# EAGLE design adapter-STDC14-DIL (EAGLE 9.6.2)
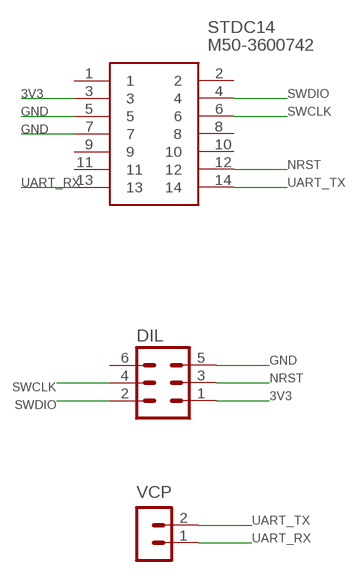
[diagram p0: schematic, sheet 1]

## Parts
DIL  MA03-2  [MA03-2]
STDC14  M50-3600742  [M50-3600742]
VCP  MA02-1  [MA02-1]

## Nets
3V3: DIL.1 STDC14.3
GND: DIL.5 STDC14.5 STDC14.7
NRST: DIL.3 STDC14.12
SWCLK: DIL.4 STDC14.6
SWDIO: DIL.2 STDC14.4
UART_RX: STDC14.13 VCP.1
UART_TX: STDC14.14 VCP.2
Unconnected: DIL.6 STDC14.1 STDC14.2 STDC14.8 STDC14.9 STDC14.10 STDC14.11

## Library data of the parts
DIL = MyComponents:MA03-2: Headers & Wire Housing, 2 Row, 6 Position; MOUSER: 649-75867-331LF
STDC14 = M50-3600742:M50-3600742: 1.27mm (0.05") Pitch DIL Vertical SMT Pin Header, selective gold + tin, 7+7 contacts Source: Datasheet <https://cdn.harwin.com/pdfs/M50-360.pdf>; DESCRIPTION: 1.27mm (0.05") Pitch DIL Vertical SMT Pin Header, selective gold + tin, 7+7 contacts; HEIGHT: mm; MANUFACTURER_NAME: Harwin; MANUFACTURER_PART_NUMBER: M50-3600742; MOUSER_PART_NUMBER: 855-M50-3600742; MOUSER_PRICE-STOCK: https://www.mouser.co.uk/ProductDetail/Harwin/M50-3600742?qs=9fQaSFfsqszE0OC0QY%2F0jw%3D%3D
VCP = MyComponents:MA02-1: Headers & Wire Housing, 1 Row, 3 Position

## Board
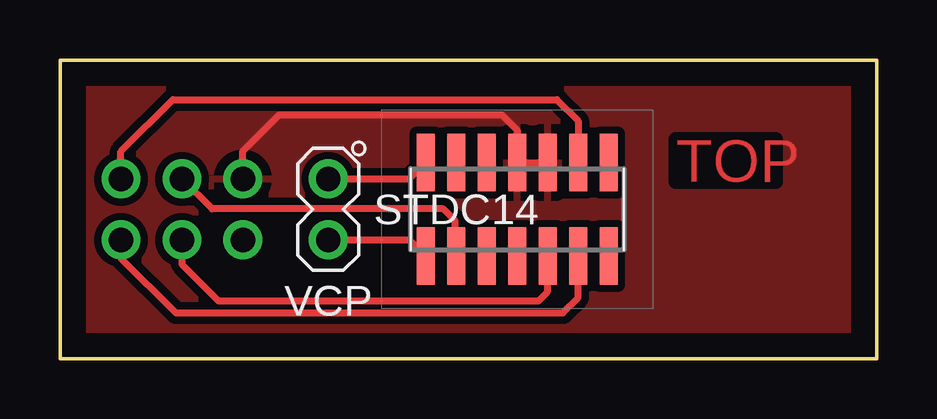
[diagram p1: board, top side]
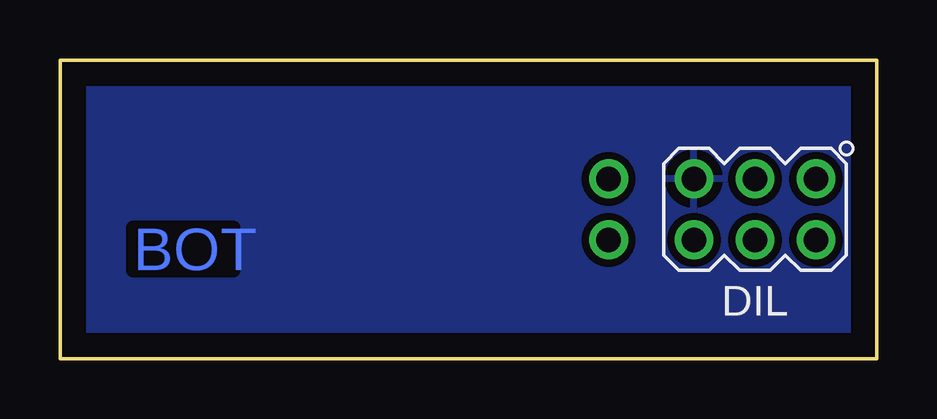
[diagram p2: board, bottom side, seen from below]

Size 34.04 x 12.45 mm. Coordinates in mm from the lower left corner, seen from the top.
Outline: 0,0 0,12.45 34.04,12.45 34.04,0 0,0
Copper layers (1*16): Top 0.035mm / dielectric 1.5mm / Bottom 0.035mm
Design rules "ENSEA_2021_gravure_humide": minimum track width 0.3mm, minimum drill 0.8mm, track to track 0.2mm, track to pad 0.2mm, pad to pad 0.185mm, via to via 0.25mm, smd to smd 0.185mm, copper to edge 1mm, drill to drill 0.4mm, minimum pad ring 0.3mm, minimum via ring 0.3mm, stop-mask expansion 4mil, vias tented up to drill 0mil, thermal gap 0.4mm

### Footprints (pad centres in the part's own frame; a part is rotated, then mirrored left to right if it is on the bottom)
MA03-2 = drill 1.016: 1 -2.54,-1.27; 2 -2.54,1.27; 3 0,-1.27; 4 0,1.27; 5 2.54,-1.27; 6 2.54,1.27
M50-3600742 = smd 0.74 x 2.4: 1 -3.81,-1.95; 2 -3.81,1.95; 3 -2.54,-1.95; 4 -2.54,1.95; 5 -1.27,-1.95; 6 -1.27,1.95; 7 0,-1.95; 8 0,1.95; 9 1.27,-1.95; 10 1.27,1.95; 11 2.54,-1.95; 12 2.54,1.95; 13 3.81,-1.95; 14 3.81,1.95
MA02-1 = drill 1.016: 1 -2.54,0; 2 0,0

### Placement (x,y rotation side)
DIL  5.08,6.22 180 bottom
STDC14  19.05,6.22 180 top
VCP  11.18,4.95 270 top

### Tracks (layer width: path | path; a pad name or v marks a point on that pad's centre or on a via)
3V3
  Top 0.3: DIL.1 2.54,8.64 4.7,10.79 20.7,10.79 21.59,9.91 STDC14.3
GND
  Top 0.3: DIL.5 7.62,8.64 9.14,10.16 18.41,10.16 19.05,9.53 STDC14.7 STDC14.5
  pour Top (isolate 0.305): 0,12.45 34.04,12.45 34.04,0 0,0
  pour Bottom (isolate 0.305): 0,12.45 34.04,12.45 34.04,0 0,0
NRST
  Top 0.3: STDC14.12 16.47,4.32 16.47,5.75 15.97,6.24 6.33,6.24 DIL.3
SWCLK
  Top 0.3: DIL.4 5.08,3.94 6.6,2.41 19.94,2.41 20.32,2.79 STDC14.6
SWDIO
  Top 0.3: DIL.2 2.54,4.19 4.83,1.91 20.95,1.91 21.59,2.54 STDC14.4
UART_RX
  Top 0.3: VCP.1 14.56,7.49 STDC14.13
UART_TX
  Top 0.3: VCP.2 14.56,4.95 STDC14.14

### Text on the board
Top: TOP
Bottom: BOT